# Altium schematic sheet GPU.SchDoc
size A3; SheetNumber: 1; SheetTotal: 1; SPICEModelCacheTWKMYQFF: <root> / <DocumentId>TWKMYQFF</DocumentId> / </root>
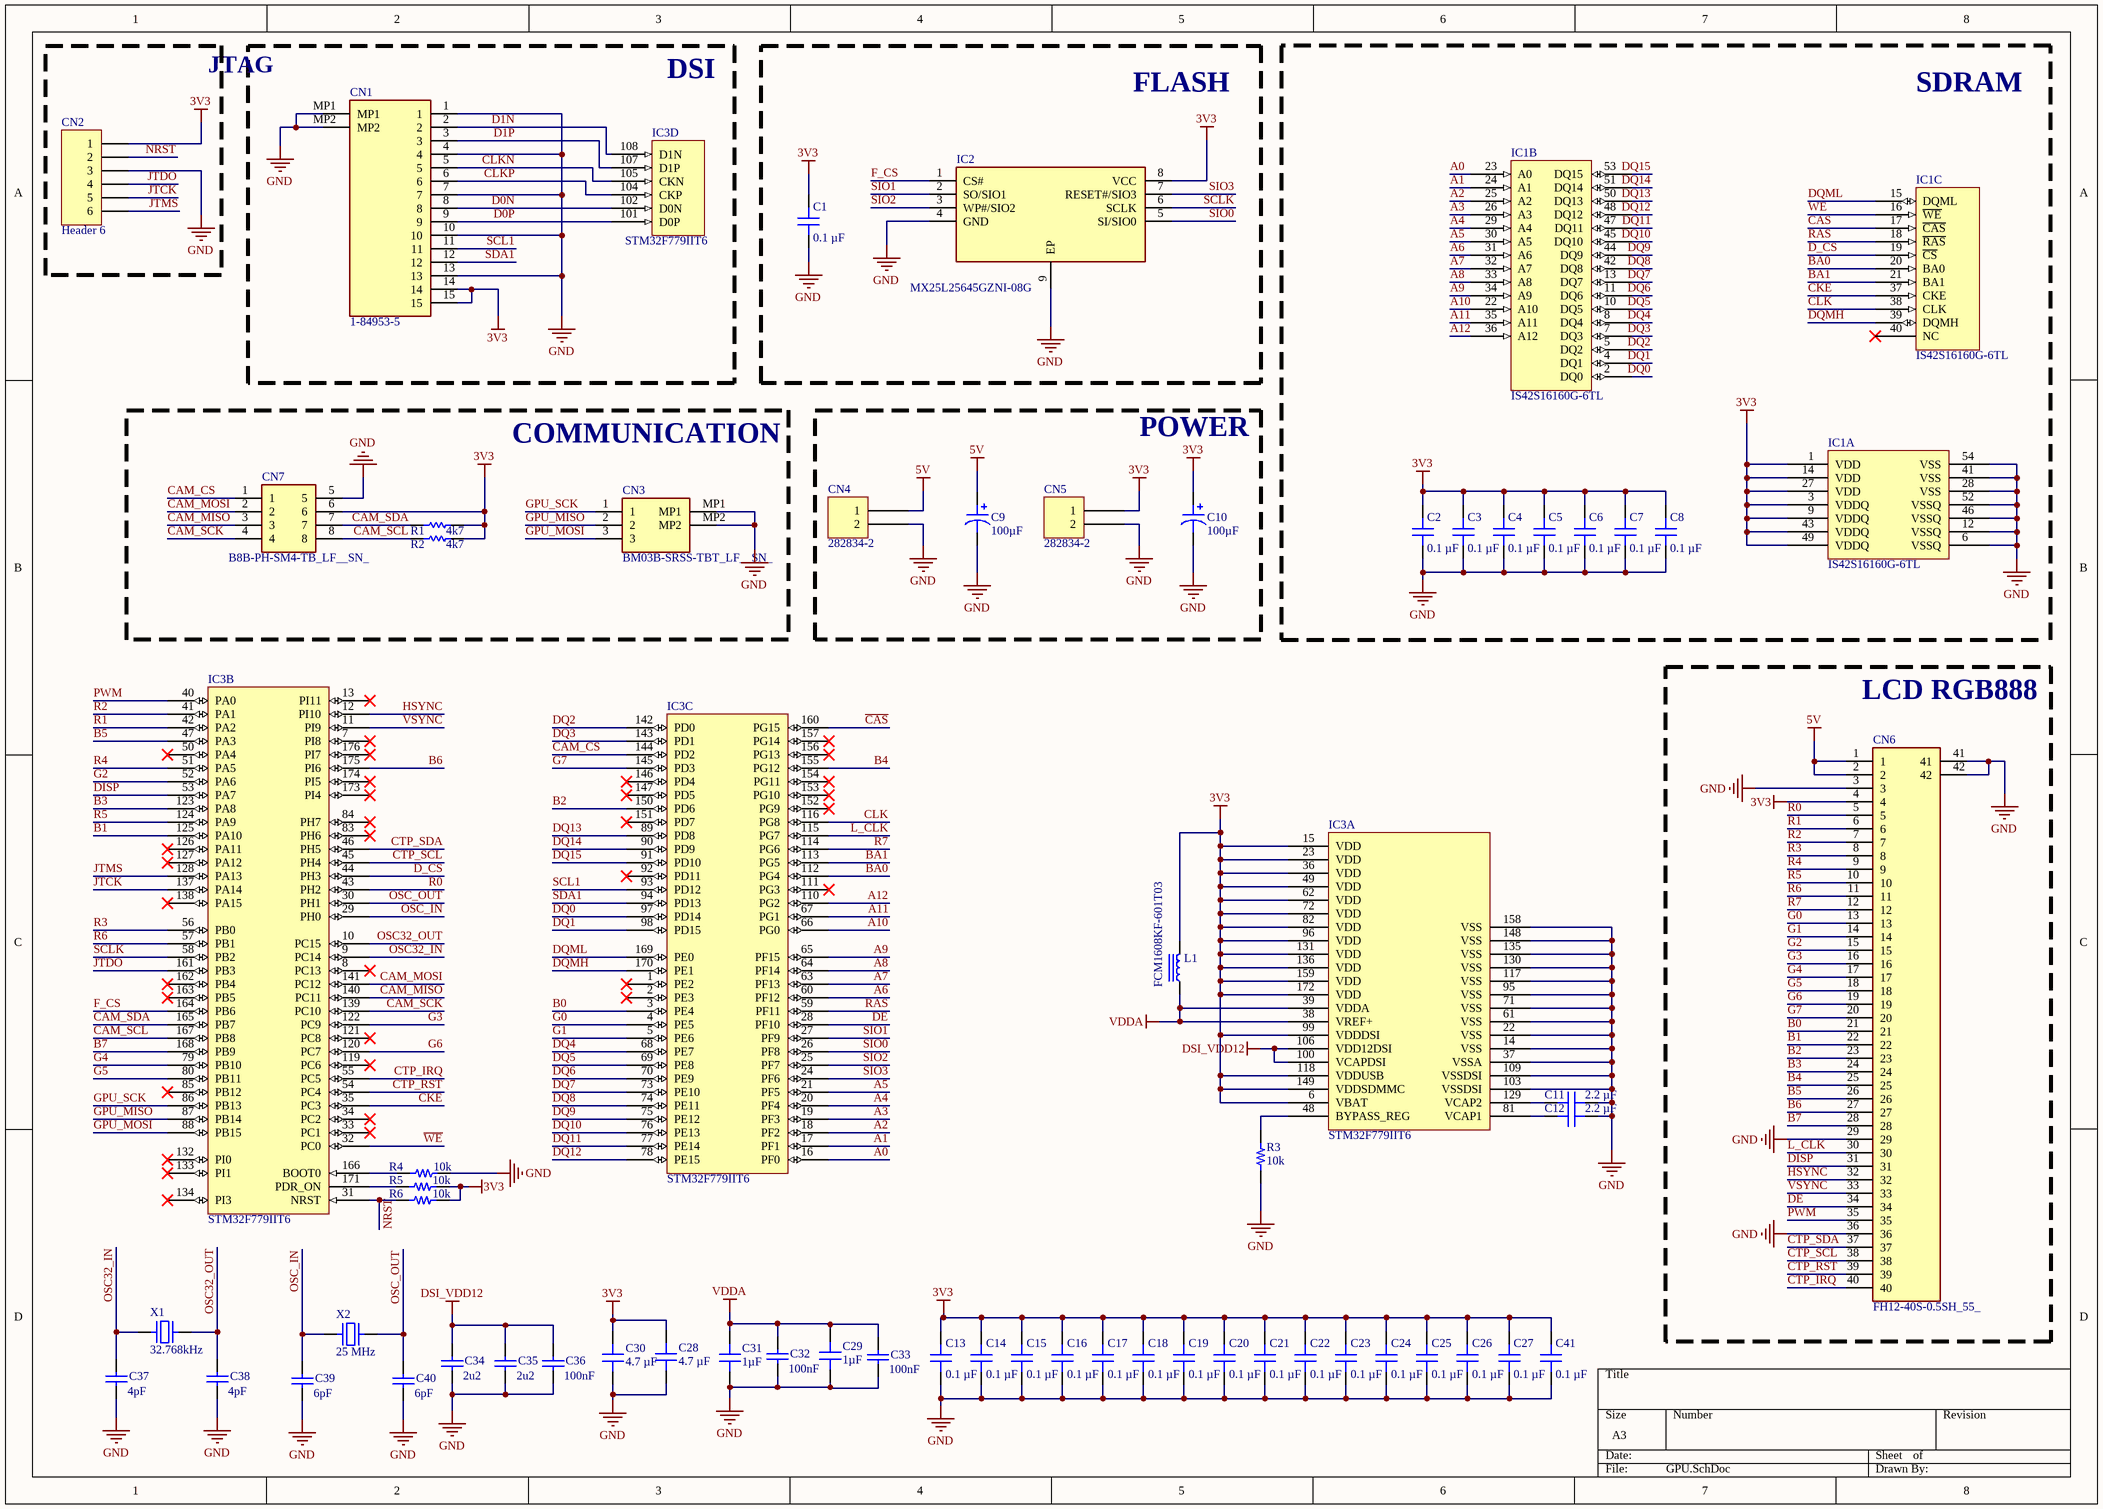
[diagram p0: GPU.SchDoc]

## Parts
(Parts that share a designator on the sheet are numbered #1, #2 ... from top to bottom, then left to right.)
C1  0.1 µF  [CAP 0603_1608]
C2  0.1 µF  [CAP 0603_1608]
C3  0.1 µF  [CAP 0603_1608]
C4  0.1 µF  [CAP 0603_1608]
C5  0.1 µF  [CAP 0603_1608]
C6  0.1 µF  [CAP 0603_1608]
C7  0.1 µF  [CAP 0603_1608]
C8  0.1 µF  [CAP 0603_1608]
C9  100µF  [CAP ALSMD POLY 5.3MM H6.0MM]
C10  100µF  [CAP ALSMD POLY 5.3MM H6.0MM]
C11  2.2 µF  [CAP 0603_1608]
C12  2.2 µF  [CAP 0603_1608]
C13  0.1 µF  [CAP 0603_1608]
C14  0.1 µF  [CAP 0603_1608]
C15  0.1 µF  [CAP 0603_1608]
C16  0.1 µF  [CAP 0603_1608]
C17  0.1 µF  [CAP 0603_1608]
C18  0.1 µF  [CAP 0603_1608]
C19  0.1 µF  [CAP 0603_1608]
C20  0.1 µF  [CAP 0603_1608]
C21  0.1 µF  [CAP 0603_1608]
C22  0.1 µF  [CAP 0603_1608]
C23  0.1 µF  [CAP 0603_1608]
C24  0.1 µF  [CAP 0603_1608]
C25  0.1 µF  [CAP 0603_1608]
C26  0.1 µF  [CAP 0603_1608]
C27  0.1 µF  [CAP 0603_1608]
C28  4.7 µF  [CAP 0603_1608]
C29  1µF  [CAP 0603_1608]
C30  4.7 µF  [CAP 0603_1608]
C31  1µF  [CAP 0603_1608]
C32  value 100nF  [1608[0603]]  (hidden comment: X5R)
C33  value 100nF  [1608[0603]]  (hidden comment: X5R)
C34  value 2u2  [1608[0603]]  (hidden comment: X5R)
C35  value 2u2  [1608[0603]]  (hidden comment: X5R)
C36  value 100nF  [1608[0603]]  (hidden comment: X5R)
C37  value 4pF  [1608[0603]]  (hidden comment: X5R)
C38  value 4pF  [1608[0603]]  (hidden comment: X5R)
C39  value 6pF  [1608[0603]]  (hidden comment: X5R)
C40  value 6pF  [1608[0603]]  (hidden comment: X5R)
C41  0.1 µF  [CAP 0603_1608]
CN1  1-84953-5  [1849535]
CN2  Header 6  [HDR1X6]
CN3  BM03B-SRSS-TBT_LF__SN_  [BM03BSRSSTBTLFSN]
CN4  282834-2  [TE 282834-2]
CN5  282834-2  [TE 282834-2]
CN6  FH12-40S-0.5SH_55_  [FH1240S05SH55]
CN7  B8B-PH-SM4-TB_LF__SN_  [B8B-PH-SM4-TB]
IC1  IS42S16160G-6TL  [SOP80P1176X120-54N]  (parts A,B,C of 3)
IC2  MX25L25645GZNI-08G  [SON127P600X500X80-9N-D]
IC3#1  STM32F779IIT6  [QFP50P2600X2600X160-176N]  (parts B,C,D of 4)
IC3#2  STM32F779IIT6  [QFP50P2600X2600X160-176N]  (part A of 3)
L1  FCM1608KF-601T03  [IND 0603_1608 RF WW]
R1  value 4k7  [1608[0603]]  (hidden comment: Res1)
R2  value 4k7  [1608[0603]]  (hidden comment: Res1)
R3  10k  [RES 0603_1608]
R4  10k  [RES 0603_1608]
R5  10k  [RES 0603_1608]
R6  10k  [RES 0603_1608]
X1  32.768kHz  [NDK NX5032GA]
X2  25 MHz  [NDK NX5032GA]

## Blocks framed on the sheet
JTAG: CN2
DSI: CN1 IC3#1
COMMUNICATION: CN3 CN7 R1 R2
POWER: C9 C10 CN4 CN5
LCD RGB888: CN6

## Nets
3V3: C1.2 C2.2 C3.2 C4.2 C5.2 C6.2 C7.2 C8.2 C10.1 C13.2 C14.2 C15.2 C16.2 C17.2 C18.2 C19.2 C20.2 C21.2 C22.2 C23.2 C24.2 C25.2 C26.2 C27.2 C28.2 C30.2 C41.2 CN1.14 CN1.15 CN2.1 CN5.1 CN6.4 CN7.6 IC1.1(VDD) IC1.3(VDDQ) IC1.9(VDDQ) IC1.14(VDD) IC1.27(VDD) IC1.43(VDDQ) IC1.49(VDDQ) IC2.8(VCC) IC3#2.6(VBAT) IC3#2.15(VDD) IC3#2.23(VDD) IC3#2.36(VDD) IC3#2.49(VDD) IC3#2.62(VDD) IC3#2.72(VDD) IC3#2.82(VDD) IC3#2.96(VDD) IC3#2.99(VDDDSI) IC3#2.118(VDDUSB) IC3#2.131(VDD) IC3#2.136(VDD) IC3#2.149(VDDSDMMC) IC3#2.159(VDD) IC3#2.172(VDD) L1.2 R1.2 R2.2 R5.1 R6.2
5V: C9.1 CN4.1 CN6.1 CN6.2
DSI_VDD12: C34.1 C35.1 C36.1 IC3#2.100(VCAPDSI) IC3#2.106(VDD12DSI)
GND: C1.1 C2.1 C3.1 C4.1 C5.1 C6.1 C7.1 C8.1 C9.2 C10.2 C11.1 C12.1 C13.1 C14.1 C15.1 C16.1 C17.1 C18.1 C19.1 C20.1 C21.1 C22.1 C23.1 C24.1 C25.1 C26.1 C27.1 C28.1 C29.1 C30.1 C31.1 C32.2 C33.2 C34.2 C35.2 C36.2 C37.2 C38.2 C39.2 C40.2 C41.1 CN1.1 CN1.4 CN1.7 CN1.10 CN1.13 CN1.MP1 CN1.MP2 CN2.3 CN3.MP1 CN3.MP2 CN4.2 CN5.2 CN6.3 CN6.29 CN6.36 CN6.41 CN6.42 CN7.5 IC1.6(VSSQ) IC1.12(VSSQ) IC1.28(VSS) IC1.41(VSS) IC1.46(VSSQ) IC1.52(VSSQ) IC1.54(VSS) IC2.4(GND) IC2.9(EP) IC3#2.14(VSS) IC3#2.22(VSS) IC3#2.37(VSSA) IC3#2.61(VSS) IC3#2.71(VSS) IC3#2.95(VSS) IC3#2.103(VSSDSI) IC3#2.109(VSSDSI) IC3#2.117(VSS) IC3#2.130(VSS) IC3#2.135(VSS) IC3#2.148(VSS) IC3#2.158(VSS) R3.2 R4.2
VDDA: C29.2 C31.2 C32.1 C33.1 IC3#2.38(VREF+) IC3#2.39(VDDA) L1.1
~{CAS}: IC1.17(~{CAS}) IC3#1.160(PG15)
~{D_}~{CS}: IC1.19(~{CS}) IC3#1.44(PH3)
~{RAS}: IC1.18(~{RAS}) IC3#1.59(PF11)
~{WE}: IC1.16(~{WE}) IC3#1.32(PC0)
A0: IC1.23(A0) IC3#1.16(PF0)
A1: IC1.24(A1) IC3#1.17(PF1)
A2: IC1.25(A2) IC3#1.18(PF2)
A3: IC1.26(A3) IC3#1.19(PF3)
A4: IC1.29(A4) IC3#1.20(PF4)
A5: IC1.30(A5) IC3#1.21(PF5)
A6: IC1.31(A6) IC3#1.60(PF12)
A7: IC1.32(A7) IC3#1.63(PF13)
A8: IC1.33(A8) IC3#1.64(PF14)
A9: IC1.34(A9) IC3#1.65(PF15)
A10: IC1.22(A10) IC3#1.66(PG0)
A11: IC1.35(A11) IC3#1.67(PG1)
A12: IC1.36(A12) IC3#1.110(PG2)
B0: CN6.21 IC3#1.3(PE4)
B1: CN6.22 IC3#1.125(PA10)
B2: CN6.23 IC3#1.150(PD6)
B3: CN6.24 IC3#1.123(PA8)
B4: CN6.25 IC3#1.155(PG12)
B5: CN6.26 IC3#1.47(PA3)
B6: CN6.27 IC3#1.175(PI6)
B7: CN6.28 IC3#1.168(PB9)
BA0: IC1.20(BA0) IC3#1.112(PG4)
BA1: IC1.21(BA1) IC3#1.113(PG5)
CAM_CS: CN7.1 IC3#1.144(PD2)
CAM_MISO: CN7.3 IC3#1.140(PC11)
CAM_MOSI: CN7.2 IC3#1.141(PC12)
CAM_SCK: CN7.4 IC3#1.139(PC10)
CAM_SCL: CN7.8 IC3#1.167(PB8) R2.1
CAM_SDA: CN7.7 IC3#1.165(PB7) R1.1
CKE: IC1.37(CKE) IC3#1.35(PC3)
CLK: IC1.38(CLK) IC3#1.116(PG8)
CLKN: CN1.5 IC3#1.105(CKN)
CLKP: CN1.6 IC3#1.104(CKP)
CTP_IRQ: CN6.40 IC3#1.55(PC5)
CTP_RST: CN6.39 IC3#1.54(PC4)
CTP_SCL: CN6.38 IC3#1.45(PH4)
CTP_SDA: CN6.37 IC3#1.46(PH5)
D0N: CN1.8 IC3#1.102(D0N)
D0P: CN1.9 IC3#1.101(D0P)
D1N: CN1.2 IC3#1.108(D1N)
D1P: CN1.3 IC3#1.107(D1P)
DE: CN6.34 IC3#1.28(PF10)
DISP: CN6.31 IC3#1.53(PA7)
DQ0: IC1.2(DQ0) IC3#1.97(PD14)
DQ1: IC1.4(DQ1) IC3#1.98(PD15)
DQ2: IC1.5(DQ2) IC3#1.142(PD0)
DQ3: IC1.7(DQ3) IC3#1.143(PD1)
DQ4: IC1.8(DQ4) IC3#1.68(PE7)
DQ5: IC1.10(DQ5) IC3#1.69(PE8)
DQ6: IC1.11(DQ6) IC3#1.70(PE9)
DQ7: IC1.13(DQ7) IC3#1.73(PE10)
DQ8: IC1.42(DQ8) IC3#1.74(PE11)
DQ9: IC1.44(DQ9) IC3#1.75(PE12)
DQ10: IC1.45(DQ10) IC3#1.76(PE13)
DQ11: IC1.47(DQ11) IC3#1.77(PE14)
DQ12: IC1.48(DQ12) IC3#1.78(PE15)
DQ13: IC1.50(DQ13) IC3#1.89(PD8)
DQ14: IC1.51(DQ14) IC3#1.90(PD9)
DQ15: IC1.53(DQ15) IC3#1.91(PD10)
DQMH: IC1.39(DQMH) IC3#1.170(PE1)
DQML: IC1.15(DQML) IC3#1.169(PE0)
F_CS: IC2.1(CS#) IC3#1.164(PB6)
G0: CN6.13 IC3#1.4(PE5)
G1: CN6.14 IC3#1.5(PE6)
G2: CN6.15 IC3#1.52(PA6)
G3: CN6.16 IC3#1.122(PC9)
G4: CN6.17 IC3#1.79(PB10)
G5: CN6.18 IC3#1.80(PB11)
G6: CN6.19 IC3#1.120(PC7)
G7: CN6.20 IC3#1.145(PD3)
GPU_MISO: CN3.2 IC3#1.87(PB14)
GPU_MOSI: CN3.3 IC3#1.88(PB15)
GPU_SCK: CN3.1 IC3#1.86(PB13)
HSYNC: CN6.32 IC3#1.12(PI10)
JTCK: CN2.5 IC3#1.137(PA14)
JTDO: CN2.4 IC3#1.161(PB3)
JTMS: CN2.6 IC3#1.128(PA13)
L_CLK: CN6.30 IC3#1.115(PG7)
NRST: CN2.2 IC3#1.31(NRST) R6.1
OSC32_IN: C37.1 IC3#1.9(PC14) X1.1
OSC32_OUT: C38.1 IC3#1.10(PC15) X1.2
OSC_IN: C39.1 IC3#1.29(PH0) X2.1
OSC_OUT: C40.1 IC3#1.30(PH1) X2.2
PWM: CN6.35 IC3#1.40(PA0)
R0: CN6.5 IC3#1.43(PH2)
R1: CN6.6 IC3#1.42(PA2)
R2: CN6.7 IC3#1.41(PA1)
R3: CN6.8 IC3#1.56(PB0)
R4: CN6.9 IC3#1.51(PA5)
R5: CN6.10 IC3#1.124(PA9)
R6: CN6.11 IC3#1.57(PB1)
R7: CN6.12 IC3#1.114(PG6)
SCL1: CN1.11 IC3#1.93(PD12)
SCLK: IC2.6(SCLK) IC3#1.58(PB2)
SDA1: CN1.12 IC3#1.94(PD13)
SIO0: IC2.5(SI/SIO0) IC3#1.26(PF8)
SIO1: IC2.2(SO/SIO1) IC3#1.27(PF9)
SIO2: IC2.3(WP#/SIO2) IC3#1.25(PF7)
SIO3: IC2.7(RESET#/SIO3) IC3#1.24(PF6)
VSYNC: CN6.33 IC3#1.11(PI9)
NetC11_2: C11.2 IC3#2.129(VCAP2)
NetC12_2: C12.2 IC3#2.81(VCAP1)
NetIC3#1_166: IC3#1.166(BOOT0) R4.1
NetIC3#1_171: IC3#1.171(PDR_ON) R5.2
NetIC3#2_48: IC3#2.48(BYPASS_REG) R3.1

Not connected (* = marked no-connect by the designer): IC1 40(NC)*; IC3#1 1(PE2)* 2(PE3)* 7(PI8)* 8(PC13)* 13(PI11)* 33(PC1)* 34(PC2)* 50(PA4)* 83(PH6)* 84(PH7)* 85(PB12)* 92(PD11)* 111(PG3)* 119(PC6)* 121(PC8)* 126(PA11)* 127(PA12)* 132(PI0)* 133(PI1)* 134(PI3)* 138(PA15)* 146(PD4)* 147(PD5)* 151(PD7)* 152(PG9)* 153(PG10)* 154(PG11)* 156(PG13)* 157(PG14)* 162(PB4)* 163(PB5)* 173(PI4)* 174(PI5)* 176(PI7)*

## Notes on the sheet
- FLASH
- SDRAM

## Library data of the parts
C1-C8 C13-C27 C41 = 0603B104K101CT: CAP CER 0.1UF 100V X7R 0603; manufacturer: Walsin Technology Corporation; Tolerance: ±10%; Part Number: 0603B104K101CT; Value: 0.1 µF; Applications: General Purpose; Capacitance: 0.1 µF; componentlink1description: Datasheet; componentlink1url: http://www.passivecomponent.com/wp-content/uploads/2018/10/MLCC.pdf; componentlink2description: DigiKey Link; componentlink2url: https://www.digikey.com/en/products/detail/walsin-technology-corporation/0603B104K101CT/9354889; Device Package: 0603 (1608 Metric); lastupdated: 4/8/2023 7:09:18 PM; Lifecycle Status: Active; Minimum Order: 1; Mounting Type: Surface Mount, MLCC; Operating Temperature: -55°C ~ 125°C; Package / Case: 0603 (1608 Metric); packaging: TapeAndReel; partid: 4273; Part Status: Active; price: 0.01; series: -; Size / Dimension: 0.063" L x 0.031" W (1.60mm x 0.80mm); Supplier 1: DigiKey; Supplier Part Number 1: 1292-1392-1-ND; Temperature Coefficient: X7R; Thickness (Max): 0.037" (0.95mm); Voltage - Rated: 100V
C9 C10 = 6SVPC100M: CAP ALUM POLY 100UF 20% 6.3V SMD; manufacturer: Panasonic Electronic Components; ESR (Equivalent Series Resistance): 30mOhm; Lifetime @ Temp.: 2000 Hrs @ 105°C; Ripple Current @ High Frequency: 2.15A @ 100kHz; Ripple Current @ Low Frequency: 107.5mA @ 120Hz; Surface Mount Land Size: 0.209" L x 0.209" W (5.30mm x 5.30mm); Type: Polymer; Part Number: 6SVPC100M; Applications: General Purpose; Capacitance: 100µF; componentlink1description: Datasheet; componentlink1url: https://industrial.panasonic.com/cdbs/www-data/pdf/AAB8000/AAB8000C256.pdf; componentlink2description: DigiKey Link; componentlink2url: http://digikey.com/product-detail/en/panasonic-electronic-components/6SVPC100M/P16606CT-ND/4204442; Device Package: Radial, Can - SMD; Height - Seated (Max): 0.236" (6.00mm); lastupdated: 9/2/2020 1:22:07 AM; Lifecycle Status: Active; Minimum Order: 1; Mounting Type: Surface Mount; Operating Temperature: -55°C ~ 105°C; Package / Case: Radial, Can - SMD; packaging: TapeAndReel; partid: 1943; Part Status: Active; price: 0.51; series: OS-CON™, SVPC; Size / Dimension: 0.197" Dia (5.00mm); Supplier 1: DigiKey; Supplier Part Number 1: P16606CT-ND; Tolerance: ±20%; value: 100µF; Voltage - Rated: 6.3V
C11 C12 = CGA3E1X7R0J225M080AC: CAP CER 2.2UF 6.3V X7R 0603; manufacturer: TDK Corporation; Tolerance: ±20%; Part Number: CGA3E1X7R0J225M080AC; Value: 2.2 µF; Applications: Automotive; Capacitance: 2.2 µF; componentlink1description: Datasheet; componentlink1url: https://product.tdk.com/info/en/catalog/datasheets/mlcc_automotive_general_en.pdf?ref_disty=digikey; componentlink2description: DigiKey Link; componentlink2url: https://www.digikey.com/en/products/detail/tdk-corporation/CGA3E1X7R0J225M080AC/3949808; Device Package: 0603 (1608 Metric); lastupdated: 4/18/2023 7:09:18 PM; Lifecycle Status: Active; Minimum Order: 1; Mounting Type: Surface Mount, MLCC; Operating Temperature: -55°C ~ 125°C; Package / Case: 0603 (1608 Metric); packaging: TapeAndReel; partid: 13580; Part Status: Active; price: 0.03; Ratings: AEC-Q200; series: CGA; Size / Dimension: 0.063" L x 0.031" W (1.60mm x 0.80mm); Supplier 1: DigiKey; Supplier Part Number 1: 445-12572-1-ND; Temperature Coefficient: X7R; Thickness (Max): 0.035" (0.90mm); Voltage - Rated: 6.3V
C28 C30 = GRM185R61C475KE11D: CAP CER 4.7UF 16V X5R 0603; manufacturer: Murata Electronics; Tolerance: ±10%; Part Number: GRM185R61C475KE11D; Value: 4.7 µF; Applications: General Purpose; Capacitance: 4.7 µF; componentlink1description: Datasheet; componentlink1url: https://search.murata.co.jp/Ceramy/image/img/A01X/G101/ENG/GRM185R61C475KE11-01.pdf; componentlink2description: DigiKey Link; componentlink2url: https://www.digikey.com/en/products/detail/murata-electronics/GRM185R61C475KE11D/6606088; Device Package: 0603 (1608 Metric); lastupdated: 3/28/2023 7:09:04 PM; Lifecycle Status: Active; Minimum Order: 1; Mounting Type: Surface Mount, MLCC; Operating Temperature: -55°C ~ 85°C; Package / Case: 0603 (1608 Metric); packaging: TapeAndReel; partid: 2451; Part Status: Active; price: 0.05; series: GRM; Size / Dimension: 0.063" L x 0.031" W (1.60mm x 0.80mm); Supplier 1: DigiKey; Supplier Part Number 1: 490-14459-1-ND; Temperature Coefficient: X5R; Thickness (Max): 0.022" (0.55mm); Voltage - Rated: 16V
C29 C31 = 0603YD105KAT4A: CAP CER 1UF 16V X5R 0603; manufacturer: AVX Corporation; Tolerance: ±10%; Part Number: 0603YD105KAT4A; Value: 1µF; Applications: General Purpose; Capacitance: 1µF; componentlink1description: Datasheet; componentlink1url: http://datasheets.avx.com/cx5r.pdf; componentlink2description: DigiKey Link; componentlink2url: http://digikey.com/product-detail/en/avx-corporation/0603YD105KAT4A/478-10365-1-ND/6797443; Device Package: 0603 (1608 Metric); lastupdated: 9/2/2020 1:03:10 AM; Lifecycle Status: Active; Minimum Order: 1; Mounting Type: Surface Mount, MLCC; Operating Temperature: -55°C ~ 85°C; Package / Case: 0603 (1608 Metric); packaging: TapeAndReel; partid: 15257; Part Status: Active; price: 0.03; series: -; Size / Dimension: 0.063" L x 0.032" W (1.60mm x 0.81mm); Supplier 1: DigiKey; Supplier Part Number 1: 478-10365-1-ND; Temperature Coefficient: X5R; Thickness (Max): 0.035" (0.90mm); Voltage - Rated: 16V
C32-C40 = Cap: Capacitor; Published: 8-Jun-2000; LatestRevisionDate: 17-Jul-2002; LatestRevisionNote: Re-released for DXP Platform.; PackageReference: RAD-0.3; Publisher: Altium Limited; PackageDescription: Radial Cap, Thru-Hole; 2 Leads; 0.3 in Pin Spacing
CN1 = 1-84953-5: Connector; Manufacturer_Name: TE Connectivity; Datasheet Link: https://www.te.com/commerce/DocumentDelivery/DDEController?Action=showdoc&DocId=Customer+Drawing%7F84953%7FA3%7Fpdf%7FEnglish%7FENG_CD_84953_A3.pdf%7F1-84953-5; Height: 2.74mm; Manufacturer_Part_Number: 1-84953-5; Mouser Part Number: 571-1-84953-5; Mouser Price/Stock: https://www.mouser.co.uk/ProductDetail/TE-Connectivity/1-84953-5?qs=uUkeXfjQ8uS9OOvsO8VIHg%3D%3D; Arrow Part Number: 1-84953-5; Arrow Price/Stock: https://www.arrow.com/en/products/1-84953-5/te-connectivity?region=nac
CN2 = Header 6: Header, 6-Pin; LatestRevisionDate: 17-Jul-2002; LatestRevisionNote: Re-released for DXP Platform.; Publisher: Altium Limited
CN3 = BM03B-SRSS-TBT_LF__SN_: Connector; Manufacturer_Name: JST (JAPAN SOLDERLESS TERMINALS); Manufacturer_Part_Number: BM03B-SRSS-TBT(LF)(SN); Datasheet Link: http://www.jst-mfg.com/product/pdf/eng/eSR.pdf; Height: 4.25mm; Arrow Part Number: BM03B-SRSS-TBT(LF)(SN); Arrow Price/Stock: https://www.arrow.com/en/products/bm03b-srss-tbt-lf-sn/jst-manufacturing
CN4 CN5 = 282834-2: TERM BLK 2P SIDE ENT 2.54MM PCB; Manufacturer: TE Connectivity AMP Connectors; Current: 10A; Mating Orientation: Horizontal with Board; Number of Levels: 1; Pitch: 0.100" (2.54mm); Positions Per Level: 2; Voltage: 150V; Wire Gauge: 16-30 AWG; Wire Termination: Screw - Rising Cage Clamp; Part Number: 282834-2; Color: Green; ComponentLink1Description: Datasheet; ComponentLink1URL: https://www.te.com/commerce/DocumentDelivery/DDEController?Action=srchrtrv&DocNm=282834&DocType=Customer+Drawing&DocLang=English; ComponentLink2Description: DigiKey Link; ComponentLink2URL: http://digikey.com/product-detail/en/te-connectivity-amp-connectors/282834-2/A98333-ND/1150135; LastUpdated: 1/15/2020 4:15:38 AM; Lifecycle Status: Active; Minimum Order: 1; Mounting Type: Through Hole; Packaging: Bulk; Part Status: Active; Price: 0.88; Series: Buchanan; Supplier 1: DigiKey; Supplier Part Number 1: A98333-ND
CN6 = FH12-40S-0.5SH_55_: Connector; Manufacturer_Name: Hirose; Manufacturer_Part_Number: FH12-40S-0.5SH(55); Datasheet Link: https://datasheet.datasheetarchive.com/originals/distributors/SFDatasheet-1/sf-00023459.pdf; Height: 2mm; Mouser Part Number: 798-FH12-40S-0.5SH55; Mouser Price/Stock: https://www.mouser.co.uk/ProductDetail/Hirose-Connector/FH12-40S-0.5SH55?qs=Ux3WWAnHpjCB5TtHwQqTgA%3D%3D; Arrow Part Number: FH12-40S-0.5SH(55); Arrow Price/Stock: https://www.arrow.com/en/products/fh12-40s-0.5sh-55/hirose-electric
CN7 = B8B-PH-SM4-TB_LF__SN_: Connector; Manufacturer_Name: JST (JAPAN SOLDERLESS TERMINALS); Manufacturer_Part_Number: B8B-PH-SM4-TB(LF)(SN); Datasheet Link: http://uk.rs-online.com/web/p/products/6881347; Arrow Part Number: B8B-PH-SM4-TB(LF)(SN); Arrow Price/Stock: https://www.arrow.com/en/products/b8b-ph-sm4-tb-lf-sn/jst-manufacturing?region=europe
IC1 = IS42S16160G-6TL: Integrated Circuit; Manufacturer_Name: Integrated Silicon Solution Inc.; Datasheet Link: http://www.issi.com/WW/pdf/42-45S83200G-16160G.pdf; Height: 1.2mm; Manufacturer_Part_Number: IS42S16160G-6TL; Mouser Part Number: 870-IS42S16160G-6TL; Mouser Price/Stock: https://www.mouser.co.uk/ProductDetail/ISSI/IS42S16160G-6TL?qs=9hm%252BDT1Jr7z36E7PiUiieg%3D%3D; Arrow Part Number: IS42S16160G-6TL; Arrow Price/Stock: https://www.arrow.com/en/products/is42s16160g-6tl/integrated-silicon-solution-inc
IC2 = MX25L25645GZNI-08G: Integrated Circuit; Manufacturer_Name: Macronix; Datasheet Link: https://www.macronix.com/Lists/Datasheet/Attachments/7858/MX25L25645G,%203V,%20256Mb,%20v1.9.pdf; Height: 0.8mm; Manufacturer_Part_Number: MX25L25645GZNI-08G; Arrow Part Number: MX25L25645GZNI-08G; Arrow Price/Stock: https://www.arrow.com/en/products/mx25l25645gzni-08g/macronix-international?region=nac
IC3#1 IC3#2 = STM32F779IIT6: Integrated Circuit; Manufacturer_Name: STMicroelectronics; Datasheet Link: https://www.arrow.com/en/products/stm32f779iit6/stmicroelectronics; Height: 1.6mm; Manufacturer_Part_Number: STM32F779IIT6; Mouser Part Number: 511-STM32F779IIT6; Mouser Price/Stock: https://www.mouser.co.uk/ProductDetail/STMicroelectronics/STM32F779IIT6?qs=qzCNEk%252BRr%252BabClKc4EG9PA%3D%3D; Arrow Part Number: STM32F779IIT6; Arrow Price/Stock: https://www.arrow.com/en/products/stm32f779iit6/stmicroelectronics?region=nac
L1 = 744917127: FIXED IND 27NH 780MA 200 MOHM; Manufacturer: Würth Elektronik; DC Resistance (DCR): 200mOhm Max; Frequency - Self Resonant: 2.8GHz; Inductance Frequency - Test: 250MHz; Material - Core: Ceramic; Q @ Freq: 35 @ 250MHz; Shielding: Unshielded; Tolerance: ±2%; Type: Wirewound; Part Number: 744917127; ComponentLink1Description: Datasheet; ComponentLink1URL: https://katalog.we-online.de/pbs/datasheet/744917127.pdf; ComponentLink2Description: DigiKey Link; ComponentLink2URL: http://digikey.com/product-detail/en/w-rth-elektronik/744917127/732-11279-1-ND/6833738; Current Rating (Amps): 780mA; Device Package: 0603 (1608 Metric); Height - Seated (Max): 0.043" (1.10mm); Inductance: 27nH; LastUpdated: 9/6/2020 11:05:16 AM; Lifecycle Status: Active; Minimum Order: 0; Mounting Type: Surface Mount; Operating Temperature: -40°C ~ 125°C; Package / Case: 0603 (1608 Metric); Packaging: TapeAndReel; PartId: 832; Part Status: Active; Price: 0.46; Series: WE-KI HC; Size / Dimension: 0.067" L x 0.043" W (1.70mm x 1.10mm); Supplier 1: DigiKey; Supplier Part Number 1: 732-11279-1-ND; Supplier Device Package: 0603 (1608 Metric); Value: 27nH
R1 R2 = Res1: Resistor; Published: 8-Jun-2000; LatestRevisionDate: 17-Jul-2002; LatestRevisionNote: Re-released for DXP Platform.; PackageReference: AXIAL-0.3; Publisher: Altium Limited; PackageDescription: Axial Device, Thru-Hole; 2 Leads; 0.3 in Pin Spacing
R3-R6 = RC0603FR-7W10KL: RES 10K OHM 1% 1/5W 0603; Manufacturer: Yageo; Power (Watts): 0.2W, 1/5W; Resistance: 10 kOhms; Temperature Coefficient: ±200ppm/°C; Part Number: RC0603FR-7W10KL; Value: 10k; ComponentLink1Description: Datasheet; ComponentLink1URL: https://www.yageo.com/upload/media/product/productsearch/datasheet/rchip/PYu-RC_Group_51_RoHS_L_11.pdf; ComponentLink2Description: DigiKey Link; ComponentLink2URL: https://www.digikey.com/en/products/detail/yageo/RC0603FR-7W10KL/12698809; Composition: Thick Film; Device Package: 0603 (1608 Metric); Features: Moisture Resistant; Height - Seated (Max): 0.022" (0.55mm); LastUpdated: 4/8/2023 7:28:57 PM; Lifecycle Status: Active; Minimum Order: 1; Number of Terminations: 2; Operating Temperature: -55°C ~ 155°C; Package / Case: 0603 (1608 Metric); Packaging: CutTape; PartId: 67088; Part Status: Active; Price: 0.01; Series: RC_L; Size / Dimension: 0.063" L x 0.031" W (1.60mm x 0.80mm); Supplier 1: DigiKey; Supplier Part Number 1: 13-RC0603FR-7W10KLCT-ND; Supplier Device Package: 0603; Tolerance: ±1%
X1 = NX5032GA-25.000000MHZ-LN-CD-1: CRYSTAL 25.0000MHZ 8PF SMD; Manufacturer: NDK America, Inc.; ESR (Equivalent Series Resistance): 70 Ohms; Frequency: 25 MHz; Frequency Stability: ±50ppm; Operating Mode: Fundamental; Value: 25 MHz; Part Number: NX5032GA-25.000000MHZ-LN-CD-1; ComponentLink1Description: Datasheet; ComponentLink1URL: //media.digikey.com/pdf/Data%20Sheets/NDK%20PDFs/NX5032GA.pdf; ComponentLink2Description: DigiKey Link; ComponentLink2URL: https://www.digikey.com/en/products/detail/ndk-america-inc/NX5032GA-25-000000MHZ-LN-CD-1/1128823; Frequency Tolerance: ±50ppm; Height - Seated (Max): 0.059" (1.50mm); LastUpdated: 3/28/2023 8:00:45 PM; Lifecycle Status: Active; Load Capacitance: 8pF; Minimum Order: 1; Mounting Type: Surface Mount; Operating Temperature: -10°C ~ 70°C; Package / Case: 2-SMD, No Lead; Packaging: TapeAndReel; PartId: 621; Part Status: Active; Price: 0.28; Series: NX5032GA; Size / Dimension: 0.197" L x 0.126" W (5.00mm x 3.20mm); Supplier 1: DigiKey; Supplier Part Number 1: 644-1041-1-ND; Type: MHz Crystal
X2 = NX5032GA-25.000000MHZ-LN-CD-1: CRYSTAL 25.0000MHZ 8PF SMD; Manufacturer: NDK America, Inc.; ESR (Equivalent Series Resistance): 70 Ohms; Frequency Stability: ±50ppm; Operating Mode: Fundamental; Part Number: NX5032GA-25.000000MHZ-LN-CD-1; ComponentLink1Description: Datasheet; ComponentLink1URL: //media.digikey.com/pdf/Data%20Sheets/NDK%20PDFs/NX5032GA.pdf; ComponentLink2Description: DigiKey Link; ComponentLink2URL: https://www.digikey.com/en/products/detail/ndk-america-inc/NX5032GA-25-000000MHZ-LN-CD-1/1128823; Frequency: 25 MHz; Frequency Tolerance: ±50ppm; Height - Seated (Max): 0.059" (1.50mm); LastUpdated: 3/28/2023 8:00:45 PM; Lifecycle Status: Active; Load Capacitance: 8pF; Minimum Order: 1; Mounting Type: Surface Mount; Operating Temperature: -10°C ~ 70°C; Package / Case: 2-SMD, No Lead; Packaging: TapeAndReel; PartId: 621; Part Status: Active; Price: 0.28; Series: NX5032GA; Size / Dimension: 0.197" L x 0.126" W (5.00mm x 3.20mm); Supplier 1: DigiKey; Supplier Part Number 1: 644-1041-1-ND; Type: MHz Crystal; Value: 25 MHz